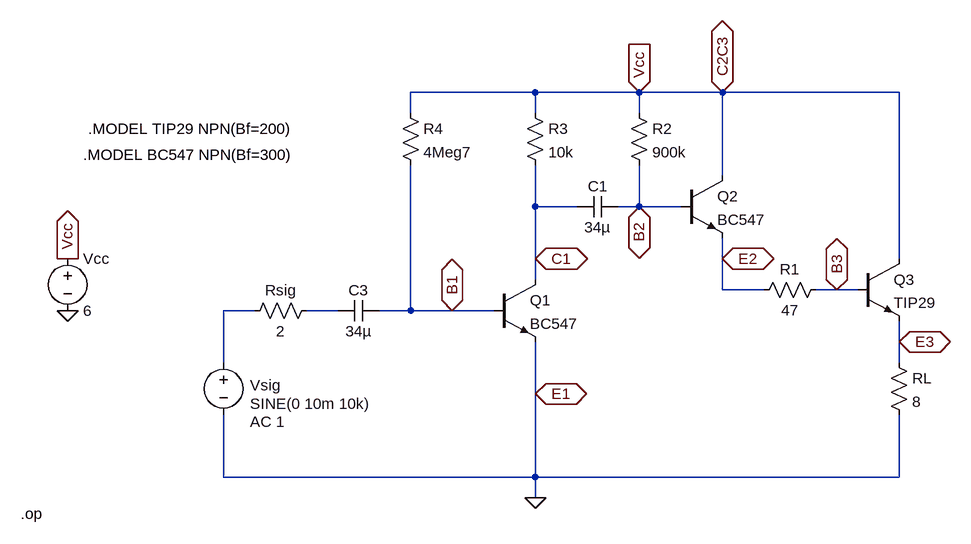
[diagram p0: schematic TBJ - Radio - AM - mod - DC operating point.asc]
TBJ - Radio - AM - mod - DC operating point.asc, the LTspice schematic file:
Version 4
SHEET 1 3324 2452
WIRE 208 -144 16 -144
WIRE 368 -144 208 -144
WIRE 496 -144 368 -144
WIRE 768 -144 496 -144
WIRE 16 -112 16 -144
WIRE 208 -112 208 -144
WIRE 368 -112 368 -144
WIRE 496 -16 496 -144
WIRE 208 32 208 -32
WIRE 272 32 208 32
WIRE 368 32 368 -32
WIRE 368 32 336 32
WIRE 432 32 368 32
WIRE 208 112 208 32
WIRE 496 112 496 80
WIRE 768 112 768 -144
WIRE 208 144 208 112
WIRE 496 160 496 112
WIRE 560 160 496 160
WIRE 672 160 640 160
WIRE 704 160 672 160
WIRE -224 192 -272 192
WIRE -96 192 -144 192
WIRE 16 192 16 -32
WIRE 16 192 -32 192
WIRE 80 192 16 192
WIRE 144 192 80 192
WIRE 768 240 768 208
WIRE -272 272 -272 192
WIRE 768 272 768 240
WIRE 208 320 208 240
WIRE -272 448 -272 352
WIRE 208 448 208 320
WIRE 208 448 -272 448
WIRE 768 448 768 352
WIRE 768 448 208 448
WIRE 208 480 208 448
FLAG 208 480 0
FLAG -512 192 0
FLAG -512 112 Vcc
IOPIN -512 112 Out
FLAG 368 -144 Vcc
IOPIN 368 -144 In
FLAG 80 192 B1
IOPIN 80 192 BiDir
FLAG 208 112 C1
IOPIN 208 112 BiDir
FLAG 208 320 E1
IOPIN 208 320 BiDir
FLAG 368 32 B2
IOPIN 368 32 BiDir
FLAG 496 -144 C2C3
IOPIN 496 -144 BiDir
FLAG 672 160 B3
IOPIN 672 160 BiDir
FLAG 768 240 E3
IOPIN 768 240 BiDir
FLAG 496 112 E2
IOPIN 496 112 BiDir
SYMBOL npn 144 144 R0
SYMATTR InstName Q1
SYMATTR Value BC547
SYMBOL npn 432 -16 R0
SYMATTR InstName Q2
SYMATTR Value BC547
SYMBOL npn 704 112 R0
SYMATTR InstName Q3
SYMATTR Value TIP29
SYMBOL res 752 256 R0
SYMATTR InstName RL
SYMATTR Value 8
SYMBOL res 656 144 R90
WINDOW 0 0 56 VBottom 2
WINDOW 3 32 56 VTop 2
SYMATTR InstName R1
SYMATTR Value 47
SYMBOL res 352 -128 R0
SYMATTR InstName R2
SYMATTR Value 900k
SYMBOL res 192 -128 R0
SYMATTR InstName R3
SYMATTR Value 10k
SYMBOL res 0 -128 R0
SYMATTR InstName R4
SYMATTR Value 4Meg7
SYMBOL cap 336 16 R90
WINDOW 0 0 32 VBottom 2
WINDOW 3 32 32 VTop 2
SYMATTR InstName C1
SYMATTR Value 34µ
SYMBOL cap -32 176 R90
WINDOW 0 0 32 VBottom 2
WINDOW 3 32 32 VTop 2
SYMATTR InstName C3
SYMATTR Value 34µ
SYMBOL voltage -272 256 R0
WINDOW 123 41 107 Left 2
WINDOW 39 0 0 Left 0
WINDOW 0 41 51 Left 2
WINDOW 3 41 79 Left 2
SYMATTR Value2 AC 1
SYMATTR InstName Vsig
SYMATTR Value SINE(0 10m 10k)
SYMBOL voltage -512 96 R0
WINDOW 123 0 0 Left 0
WINDOW 39 0 0 Left 0
SYMATTR InstName Vcc
SYMATTR Value 6
SYMBOL res -128 176 R90
WINDOW 0 0 56 VBottom 2
WINDOW 3 32 56 VTop 2
SYMATTR InstName Rsig
SYMATTR Value 2
TEXT -480 -88 Left 2 !.MODEL TIP29 NPN(Bf=200)
TEXT -488 -48 Left 2 !.MODEL BC547 NPN(Bf=300)
TEXT -584 504 Left 2 !.op

The netlist it stands for:
* TBJ - Radio - AM - mod - DC operating point.asc
Q1 C1 B1 0 0 BC547
Q2 C2C3 B2 E2 0 BC547
Q3 C2C3 B3 E3 0 TIP29
RL E3 0 8
R1 B3 E2 47
R2 C2C3 B2 900k
R3 C2C3 C1 10k
R4 C2C3 B1 4Meg7
C1 B2 C1 34µ
C3 B1 N002 34µ
Vsig N001 0 SINE(0 10m 10k) AC 1
Vcc C2C3 0 6
Rsig N002 N001 2
.model NPN NPN
.model PNP PNP
.lib standard.bjt
.MODEL TIP29 NPN(Bf=200)
.MODEL BC547 NPN(Bf=300)
.op
.backanno
.end